# Altium schematic sheet Diagram.SchDoc
size A4; SheetNumber: 1; SheetTotal: 7
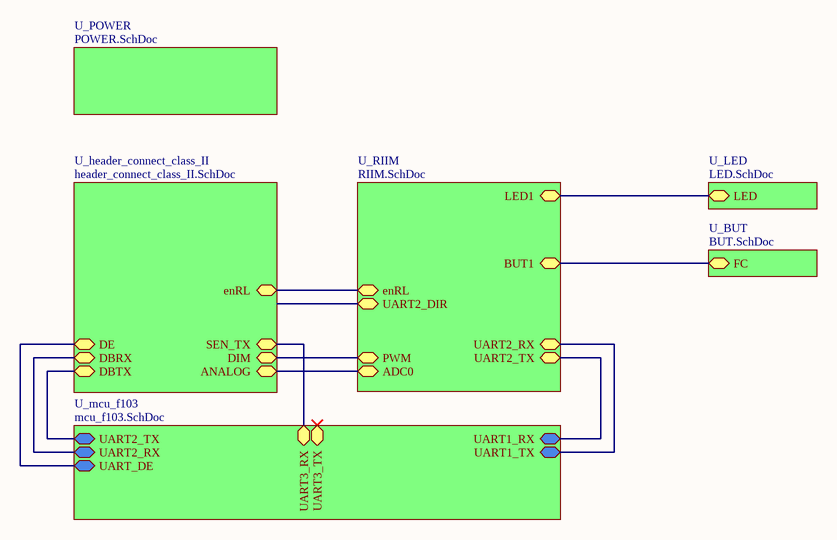
[diagram p0: Diagram.SchDoc]

## Sub-sheets
U_BUT = BUT.SchDoc: FC (bidir)
U_header_connect_class_II = header_connect_class_II.SchDoc: SEN_TX (bidir), DE (bidir), DBRX (bidir), DBTX (bidir), ANALOG (bidir), DIM (bidir), enRL (bidir)
U_LED = LED.SchDoc: LED (bidir)
U_mcu_f103 = mcu_f103.SchDoc: UART2_TX (bidir), UART2_RX (bidir), UART1_RX (bidir), UART1_TX (bidir), UART_DE (bidir), UART3_TX (bidir), UART3_RX (bidir)
U_POWER = POWER.SchDoc: no entries
U_RIIM = RIIM.SchDoc: LED1 (bidir), BUT1 (bidir), PWM (bidir), UART2_TX (bidir), UART2_RX (bidir), UART2_DIR (bidir), ADC0 (bidir), enRL (bidir)

## Nets
(unnamed): sheet U_BUT/FC, sheet U_RIIM/BUT1
(unnamed): sheet U_header_connect_class_II/SEN_TX, sheet U_mcu_f103/UART3_RX
(unnamed): sheet U_header_connect_class_II/DE, sheet U_mcu_f103/UART_DE
(unnamed): sheet U_header_connect_class_II/DBRX, sheet U_mcu_f103/UART2_RX
(unnamed): sheet U_header_connect_class_II/DBTX, sheet U_mcu_f103/UART2_TX
(unnamed): sheet U_header_connect_class_II/ANALOG, sheet U_RIIM/ADC0
(unnamed): sheet U_header_connect_class_II/DIM, sheet U_RIIM/PWM
(unnamed): sheet U_header_connect_class_II/enRL, sheet U_RIIM/enRL
(unnamed): sheet U_LED/LED, sheet U_RIIM/LED1
(unnamed): sheet U_RIIM/UART2_TX, sheet U_mcu_f103/UART1_RX
(unnamed): sheet U_RIIM/UART2_RX, sheet U_mcu_f103/UART1_TX